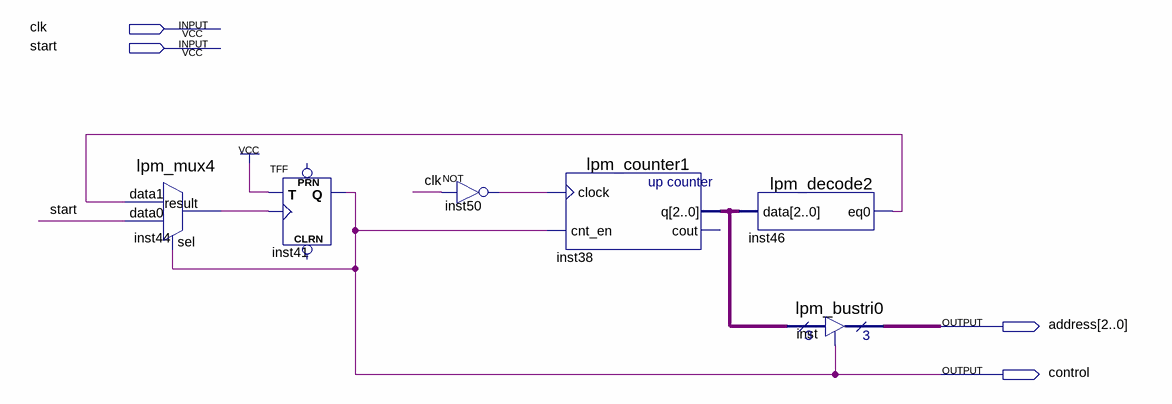
[diagram p0: schematic sheet]
// Quartus schematic continuous_ram_control.bdf as structural Verilog: 6 symbols, 4 pins
module continuous_ram_control (
  input  clk,
  input  start,
  output [2:0] address,
  output control
);

  wire inst44_result, inst46_eq0, inst50_out;
  wire [2:0] inst38_q;

  lpm_mux4 inst44 (.data1(inst46_eq0), .data0(start), .sel(control), .result(inst44_result));
  TFF inst41 (.T(1'b1), .CLK(inst44_result), .Q(control));  // open: PRN, CLRN
  not inst50 (inst50_out, clk);
  lpm_counter1 inst38 (.clock(inst50_out), .cnt_en(control), .q(inst38_q));  // open: cout
  lpm_decode2 inst46 (.data(inst38_q), .eq0(inst46_eq0));
  lpm_bustri0 inst (.enabledt(control), .data(inst38_q), .tridata(address));
endmodule
